# Altium schematic sheet AuxHalfH.SchDoc
size A3; SheetNumber: 4
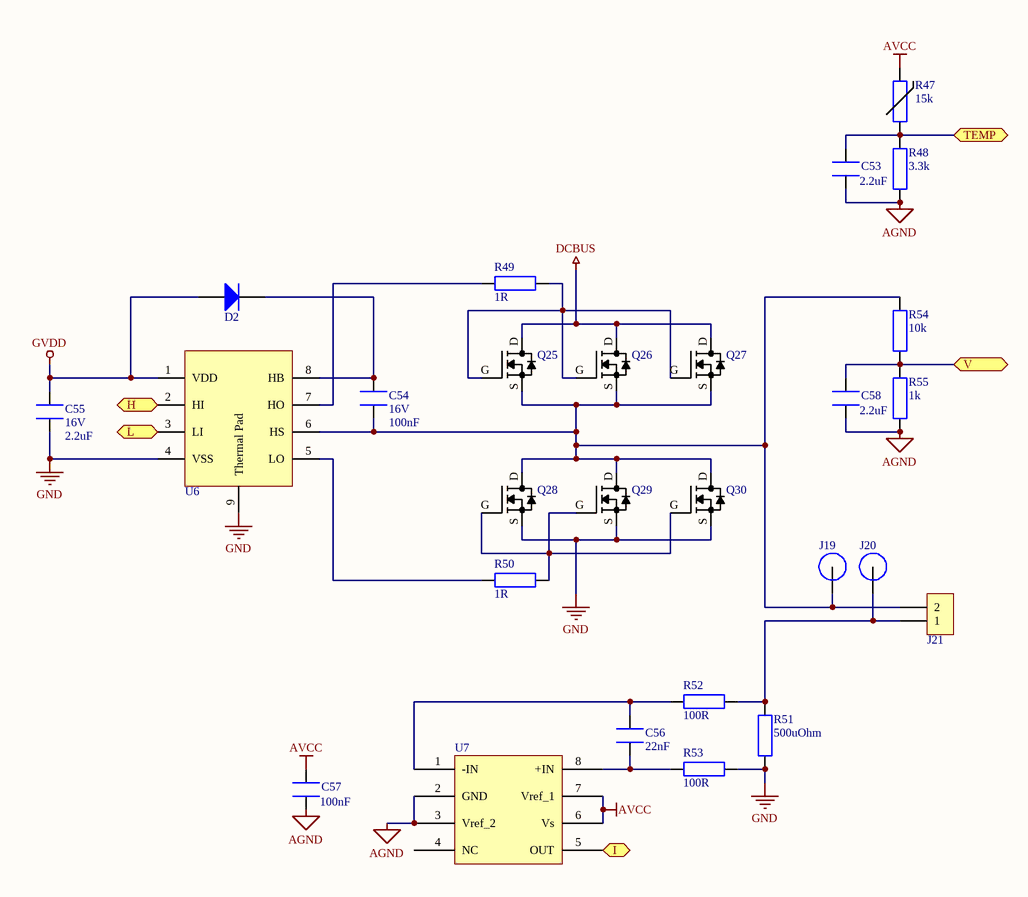
[diagram p0: AuxHalfH.SchDoc]

## Parts
C53  value 2.2uF  [1608[0603]]
C54  16V  value 100nF  [1608[0603]]
C55  16V  value 2.2uF  [1608[0603]]
C56  value 22nF  [1608[0603]]
C57  value 100nF  [1608[0603]]
C58  value 2.2uF  [1608[0603]]
D2  (no value)  [DIOM2717X10N]
J19  (no value)  [M3 Spade Hole]
J20  (no value)  [M3 Spade Hole]
J21  (no value)  [MC000054]
Q25  (no value)  [SO8FL_FILL]
Q26  (no value)  [SO8FL]
Q27  (no value)  [SO8FL_FILL]
Q28  (no value)  [SO8FL]
Q29  (no value)  [SO8FL]
Q30  (no value)  [SO8FL]
R47  value 15k  [RESC1608X06L]
R48  value 3.3k  [RESC1608X55N]
R49  value 1R  [RESC1608X55N]
R50  value 1R  [RESC1608X55N]
R51  value 500uOhm  [RESC6432X09N]
R52  value 100R  [RESC1608X55N]
R53  value 100R  [RESC1608X55N]
R54  value 10k  [RESC1608X55N]
R55  value 1k  [RESC1608X55N]
U6  (no value)  [SON80P400X80_HS-9N]
U7  (no value)  [SOIC127P600X175-8N]

## Ports
H, I, L, TEMP, V

## Nets
AGND: C53.1 C57.2 C58.1 R48.2 R55.2 U7.2(GND) U7.3(Vref_2)
AVCC: C57.1 R47.2 U7.6(Vs) U7.7(Vref_1)
DCBUS: Q25.D Q26.D Q27.D
GND: C55.1 Q28.S Q29.S Q30.S R51.2 R53.2 U6.4(VSS) U6.9(Thermal_Pad)
GVDD: C55.2 D2.A U6.1(VDD)
H: U6.2(HI) ; port H
I: U7.5(OUT) ; port I
L: U6.3(LI) ; port L
TEMP: C53.2 R47.1 R48.1 ; port TEMP
V: C58.2 R54.2 R55.1 ; port V
NetC54_1: C54.1 D2.K U6.8(HB)
NetC54_2: C54.2 J19.1 J21.2 Q25.S Q26.S Q27.S Q28.D Q29.D Q30.D R54.1 U6.6(HS)
NetC56_1: C56.1 R52.1 U7.1(-IN)
NetC56_2: C56.2 R53.1 U7.8(+IN)
NetJ20_1: J20.1 J21.1 R51.1 R52.2
NetQ25_G: Q25.G Q26.G Q27.G R49.2
NetQ28_G: Q28.G Q29.G Q30.G R50.2
NetR49_1: R49.1 U6.7(HO)
NetR50_1: R50.1 U6.5(LO)

Not connected (* = marked no-connect by the designer): U7 4(NC)

## Library data of the parts
C53-C58 = CAP_0603: CAP General 0603
D2 = MBR140SFT1G: Rectifier Diode, Single, 40 V, 1 A, SOD-123FL, 2, 550 mV
J19 J20 = M3 Spade Terminal
J21 = MC000054: MULTICOMP Wire-To-Board Terminal Block, 2, 600 V, 30 A, 24 AWG, 10 AWG
Q25-Q30 = NTMFS4937NT1G: MOSFET, N CH, 30V, 70A, SO-8 FL; Supplier 1: Farnell; Supplier Part Number 1: 2317605; Supplier 2: Farnell; Supplier Part Number 2: 2317605RL
R47 = NTCS0603E3153JMT: THERMISTOR, 15K, 5%, SMD, NTC; Supplier 1: Farnell; Supplier Part Number 1: 2103168
R48-R50 R52-R55 = RES_0603: RES General 1% 0603
R51 = CSR2512C0R0005F: RES SMD 0.0005 OHM 1% 3W 2512
U6 = LM5109BSD/NOPB: DRIVER, MOSFET, HALF BRIDGE, WSON-8, 1A; Supplier 1: Farnell; Supplier Part Number 1: 2400642RL; Supplier 2: Farnell; Supplier Part Number 2: 2400642; Supplier 3: Farnell; Supplier Part Number 3: 2382850
U7 = AD8418WBRZ: ANALOG DEVICES Current Sense Amplifier, Bidirectional, 1, 130 µA, NSOIC